# Altium schematic sheet SCH_12-volt-power-Altium.schdoc
size 271 x 100 mm
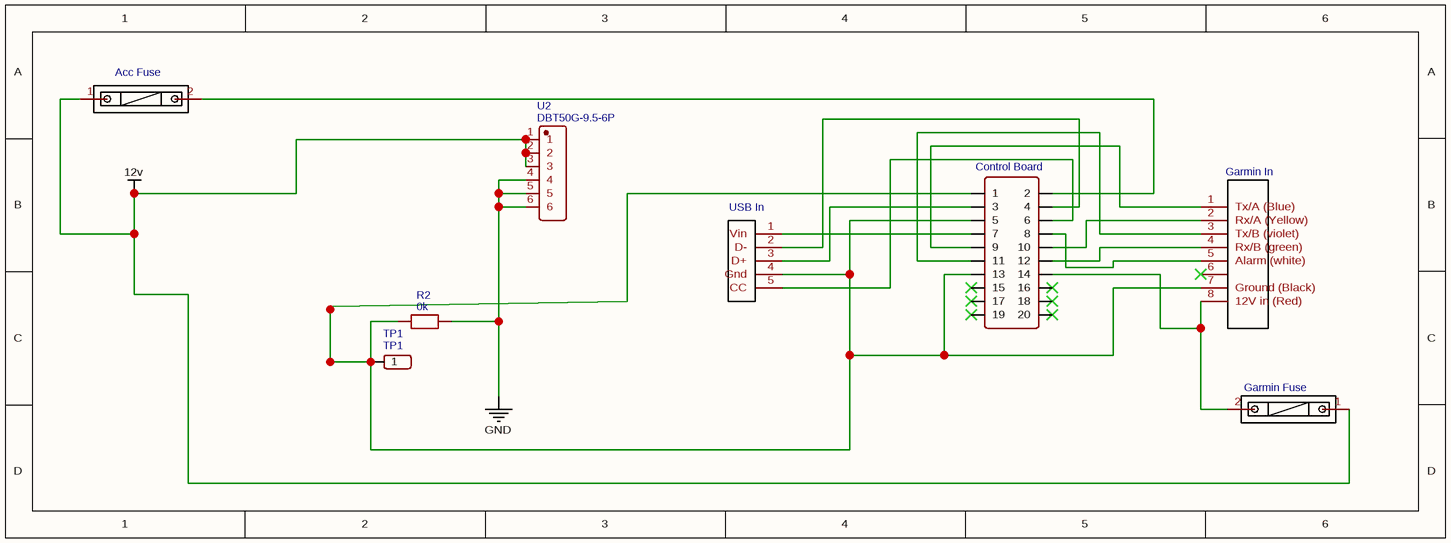
[diagram p0: SCH_12-volt-power-Altium.schdoc]

## Parts
ACC-FUSE-5X20=BLX-ATYPE-FUSE-HOLDER  Acc Fuse  [FUSE-TH_L22.6-W9.0]
BUTTON_LED1  Control Board  [HDR-M-2.54_2X10]
GARMIN-FUSE-5X20-BLX-ATYPE-FUSE-HOLDER  Garmin Fuse  [FUSE-TH_L22.6-W9.0]
GARMIN-GPS  Garmin In  [JST-XH-8PIN-2.5]
R2  0k  [R_AXIAL-0.3]
TP1  TP1  [HDR-M-2.54_1X1]
U2  DBT50G-9.5-6P  [CONN-TH_6P-P9.50_DBT50G-9.5-6P]
USB-C  USB In  [JST XH 1X5]

## Nets
12v: ACC-FUSE-5X20=BLX-ATYPE-FUSE-HOLDER.1 GARMIN-FUSE-5X20-BLX-ATYPE-FUSE-HOLDER.1 U2.1 U2.2 U2.3
GND: R2.2 U2.4 U2.5 U2.6
NetACC-FUSE-5X20=BLX-ATYPE-FUSE-HOLDER_2: ACC-FUSE-5X20=BLX-ATYPE-FUSE-HOLDER.2 BUTTON_LED1.2
NetBUTTON_LED1_1: BUTTON_LED1.1 BUTTON_LED1.5 BUTTON_LED1.13 GARMIN-GPS.7(Ground_(Black)) R2.1 TP1.1 USB-C.4(Gnd)
NetBUTTON_LED1_3: BUTTON_LED1.3 USB-C.3(D+)
NetBUTTON_LED1_4: BUTTON_LED1.4 USB-C.2(D-)
NetBUTTON_LED1_6: BUTTON_LED1.6 USB-C.5(CC)
NetBUTTON_LED1_7: BUTTON_LED1.7 USB-C.1(Vin)
NetBUTTON_LED1_8: BUTTON_LED1.8 GARMIN-GPS.5(Alarm_(white))
NetBUTTON_LED1_9: BUTTON_LED1.9 GARMIN-GPS.1(Tx/A_(Blue))
NetBUTTON_LED1_10: BUTTON_LED1.10 GARMIN-GPS.2(Rx/A_(Yellow))
NetBUTTON_LED1_11: BUTTON_LED1.11 GARMIN-GPS.3(Tx/B_(violet))
NetBUTTON_LED1_12: BUTTON_LED1.12 GARMIN-GPS.4(Rx/B_(green))
NetBUTTON_LED1_14: BUTTON_LED1.14 GARMIN-FUSE-5X20-BLX-ATYPE-FUSE-HOLDER.2 GARMIN-GPS.8(12V_in_(Red))

Not connected (* = marked no-connect by the designer): BUTTON_LED1 15* 16* 17* 18* 19* 20*; GARMIN-GPS 6(Accessory_On)*

## Library data of the parts
ACC-FUSE-5X20=BLX-ATYPE-FUSE-HOLDER = Acc Fuse: Manufacturer Part: 5x20 BLX-A型 保险丝支架 XC-7; Manufacturer: xcfuse(旭程); Supplier: LCSC; Supplier Part: C3131; JLCPCB Part Class: Extended Part; spicePre: F; spiceSymbolName: 5x20 BLX-Atype Fuse holder XC-7
BUTTON_LED1 = Control Board: Contributor: LCEDA_Lib; Supplier Part: C124359; Supplier: LCSC; spicePre: J; spiceSymbolName: HDR-M-2.54_2x10
GARMIN-FUSE-5X20-BLX-ATYPE-FUSE-HOLDER = Garmin Fuse: Manufacturer Part: 5x20 BLX-A型 保险丝支架 XC-7; Manufacturer: xcfuse(旭程); Supplier: LCSC; Supplier Part: C3131; JLCPCB Part Class: Extended Part; spicePre: F; spiceSymbolName: 5x20 BLX-Atype Fuse holder XC-7
GARMIN-GPS = Garmin In: Manufacturer: Waveshare; Contributor: Robciog1968; spicePre: U; spiceSymbolName: 8PIN JST CONNECTOR
R2 = 0k: nameAlias: Value(Ω); Contributor: LCEDA_Lib; spicePre: R; spiceSymbolName: R_AXIAL-0.3_EU
TP1 = TP1: Contributor: LCEDA_Lib; Package Display: No; Supplier Part: C81276; Supplier: LCSC; spicePre: J; spiceSymbolName: HDR-M-2.54_1x1
U2 = DBT50G-9.5-6P: Manufacturer: DORABO(地博电气); Manufacturer Part: DBT50G-9.5-6P-BK-P OGC; Contributor: LCSC; Supplier: LCSC; Supplier Part: C430698; JLCPCB Part Class: Extended Part; spicePre: U; spiceSymbolName: DBT50G-9.5-6P
USB-C = USB In: Contributor: GeMeMe; spicePre: U; spiceSymbolName: JST XH 1x5